# EAGLE design Power_feed (EAGLE 6.3)
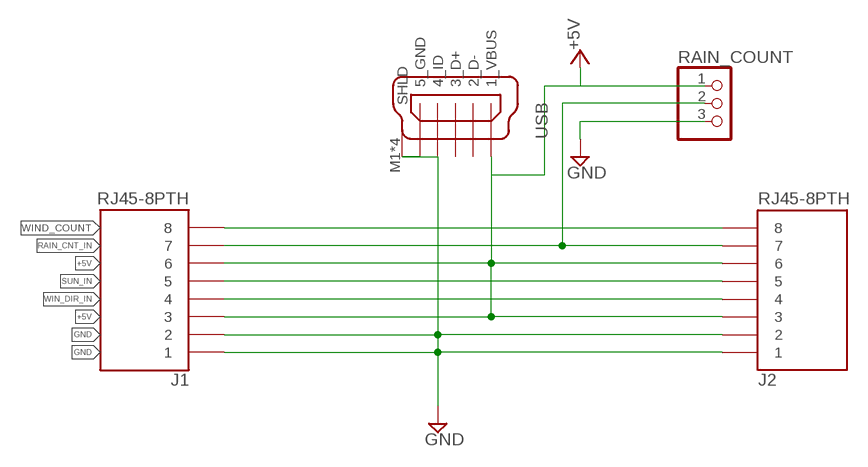
[diagram p0: schematic, sheet 1]

## Parts
J1  RJ45-8PTH  [RJ45-8]
J2  RJ45-8PTH  [RJ45-8]
RAIN_COUNT  PINHD-1X3  [1X03]
USB  MINI-USB-32005-301  [32005-301]

## Nets
+5V: J1.3 J1.6 J2.3 J2.6 RAIN_COUNT.1 USB.1_VBUS
GND: J1.1 J1.2 J2.1 J2.2 RAIN_COUNT.3 USB.5_USB_GND(5_GND) USB.M1(SHLD) USB.M2(SHLD) USB.M3(SHLD) USB.M4(SHLD)
RAIN_CNT_IN: J1.7 J2.7 RAIN_COUNT.2
SUN_IN: J1.5 J2.5
WIN_DIR_IN: J1.4 J2.4
WIND_COUNT: J1.8 J2.8
Unconnected: USB.2_D- USB.3_D+ USB.4_ID

## Library data of the parts
J1 J2 = wifi_WX:RJ45-8: RJ45 Jack Simple RJ45, 8-pin connection - connector for common Cat5, Cat5e, and Cat6 Ethernet cables. Footprint not yet proven in production. Connector sku is PRT-00643; Breakout PCB sku is BOB-00716.
RAIN_COUNT = wifi_WX:PINHD-1X3: PIN HEADER
USB = wifi_WX:MINI-USB-: MINI USB-B Conector Source: www.cypressindustries.com

## Board
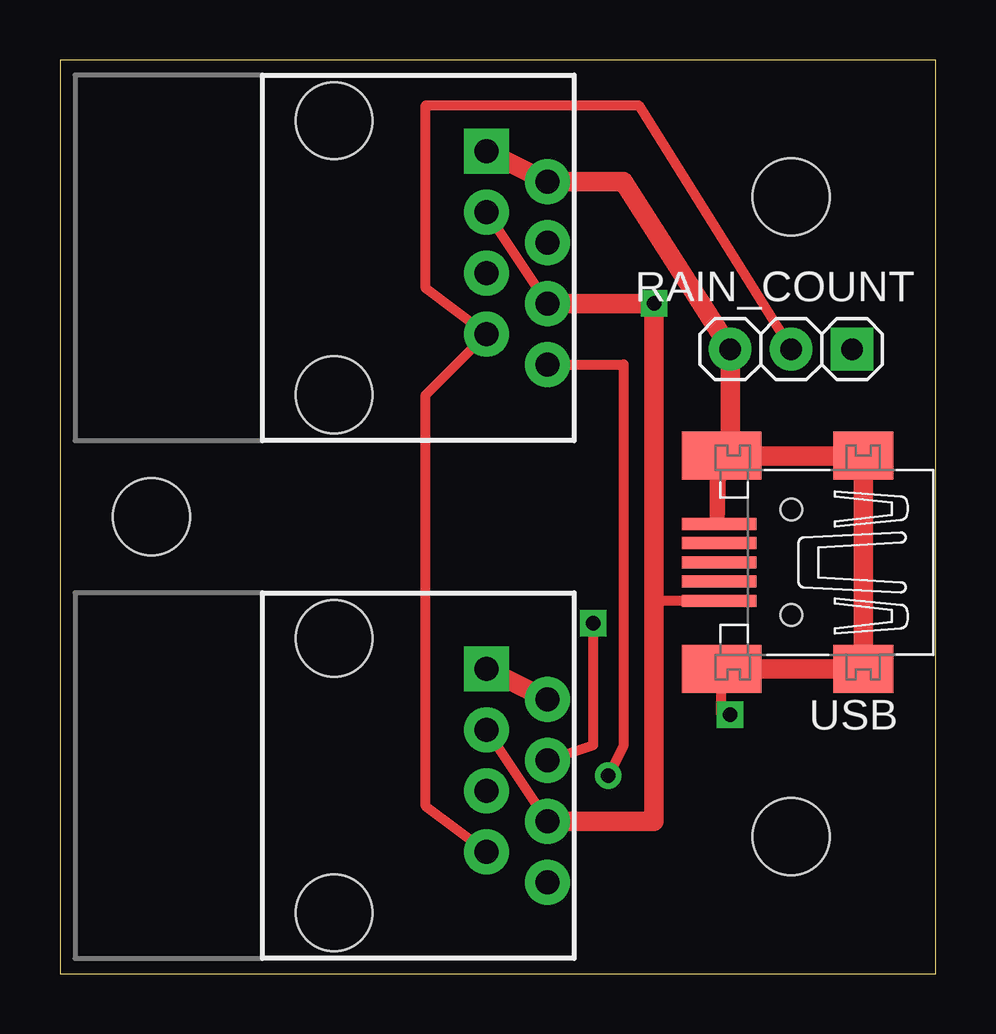
[diagram p1: board, top side]
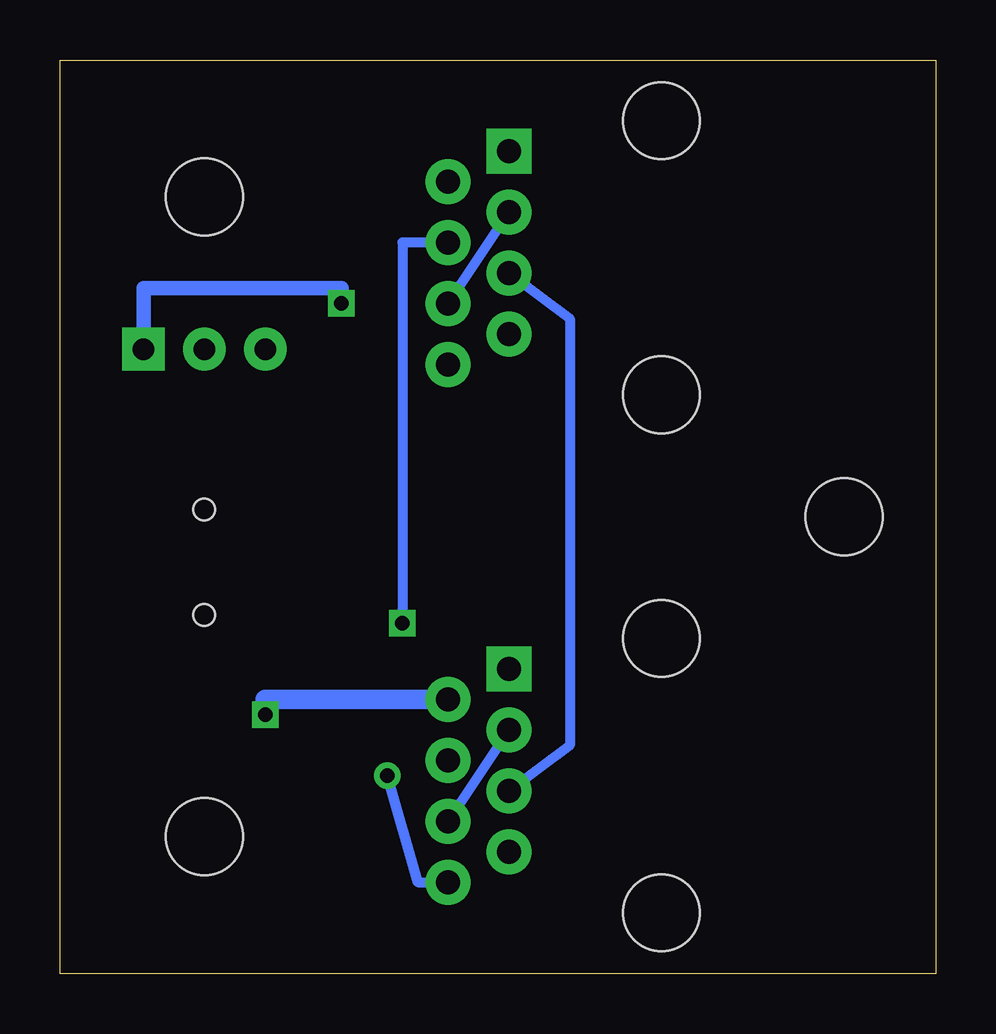
[diagram p2: board, bottom side, seen from below]

Size 36.5 x 38.09 mm. Coordinates in mm from the lower left corner, seen from the top.
Outline: 0,0 36.5,0 36.5,38.09 0,38.09 0,0
Copper layers (1*16): Top 0.035mm / dielectric 1.5mm / Bottom 0.035mm
Design rules "sparkfun": minimum track width 8mil, minimum drill 20mil, track to track 8mil, track to pad 8mil, pad to pad 8mil, via to via 8mil, smd to smd 8mil, copper to edge 10mil, drill to drill 8mil, minimum pad ring 12mil, minimum via ring 10mil, stop-mask expansion 4mil, vias tented up to drill 25mil, thermal gap 10mil
Holes 3.2 mm at 30.48,5.72 30.48,32.39 3.81,19.05

### Footprints (pad centres in the part's own frame; a part is rotated, then mirrored left to right if it is on the bottom)
RJ45-8 = drill 1 pad 1.88 square: 1 -4.445,6.35 | drill 1 pad 1.88: 2 -3.175,8.89; 3 -1.905,6.35; 4 -0.635,8.89; 5 0.635,6.35; 6 1.905,8.89; 7 3.175,6.35; 8 4.445,8.89 | hole 3.2: -5.715,0; 5.715,0
1X03 = drill 0.9 pad 1.778 square: 1 -2.54,0 | drill 0.9 pad 1.778: 2 0,0; 3 2.54,0
32005-301 = smd 3.1 x 0.5: 1_VBUS 3,1.6; 2_D- 3,0.8; 3_D+ 3,0; 4_ID 3,-0.8; 5_USB_GND 3,-1.6 | smd 2.5 x 2: M1 -3,-4.45; M2 -3,4.45 | smd 3.3 x 2: M3 2.9,4.45; M4 2.9,-4.45 | hole 0.9: 0,2.2; 0,-2.2

### Placement (x,y rotation side)
J1  11.43,29.85 270 top
J2  11.43,8.25 270 top
RAIN_COUNT  30.48,26.04 180 top
USB  30.48,17.14 180 top

### Tracks (layer width: path | path; a pad name or v marks a point on that pad's centre or on a via)
+5V  (via drill 0.6)
  Top 0.406: USB.1_VBUS 24.77,15.54 | J1.3 J1.6 | J2.3 J2.6
  Top 0.813: J2.6 24.77,6.35 24.77,15.54 v24.77,27.94 J1.6
  Bottom 0.406: J2.3 J2.6 | J1.6 J1.3
  Bottom 0.61: RAIN_COUNT.1 33.02,28.57 24.77,28.57 v24.77,27.94
GND  (via drill 0.6)
  Top 0.406: USB.M1 USB.M4 | USB.M4 USB.5_USB_GND 27.3,18.75 27.3,21.59 | USB.M2 33.65,12.7 33.66,12.7 | v27.94,10.8 27.58,10.8 USB.M3 | 27.94,21.59 USB.M4
  Top 0.813: USB.M3 USB.M2 USB.M1 27.3,21.59 | J1.1 J1.2 23.49,33.02 RAIN_COUNT.3 27.94,21.59 | J2.2 J2.1
  Bottom 0.406: 27.94,11.43 v27.94,10.8
  Bottom 0.813: J2.2 27.94,11.43
RAIN_CNT_IN
  Top 0.406: J2.7 15.24,6.99 15.24,24.13 J1.7 15.24,28.57 15.24,36.2 24.13,36.2 RAIN_COUNT.2
SUN_IN
  Bottom 0.406: J1.5 15.24,27.3 15.24,9.52 J2.5
WIN_DIR_IN  (via drill 0.6)
  Top 0.406: v22.23,14.61 22.23,9.52 J2.4
  Bottom 0.406: J1.4 22.23,30.48 v22.23,14.61
WIND_COUNT  (via drill 0.6)
  Top 0.406: v22.86,8.25 23.49,9.52 23.49,25.4 J1.8
  Bottom 0.406: v22.86,8.25 21.59,3.81 J2.8